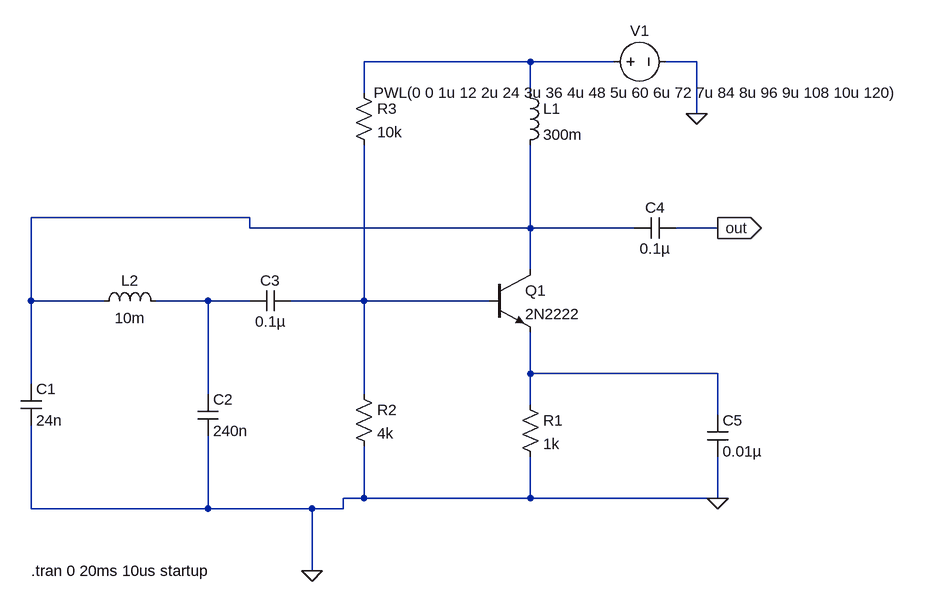
[diagram p0: schematic Colpitt.asc]
Colpitt.asc, the LTspice schematic file:
Version 4
SHEET 1 948 680
WIRE 336 -224 80 -224
WIRE 464 -224 336 -224
WIRE 592 -224 544 -224
WIRE 80 -176 80 -224
WIRE 336 -176 336 -224
WIRE 592 -144 592 -224
WIRE -96 16 -432 16
WIRE -96 32 -96 16
WIRE 336 32 336 -96
WIRE 336 32 -96 32
WIRE 496 32 336 32
WIRE 624 32 560 32
WIRE 336 96 336 32
WIRE -432 144 -432 16
WIRE -320 144 -432 144
WIRE -160 144 -240 144
WIRE -96 144 -160 144
WIRE 80 144 80 -96
WIRE 80 144 -32 144
WIRE 272 144 80 144
WIRE 336 256 336 192
WIRE 624 256 336 256
WIRE -432 272 -432 144
WIRE -160 288 -160 144
WIRE 80 288 80 144
WIRE 336 304 336 256
WIRE 624 320 624 256
WIRE 80 448 80 368
WIRE 80 448 48 448
WIRE 336 448 336 384
WIRE 336 448 80 448
WIRE 624 448 624 384
WIRE 624 448 336 448
WIRE -432 464 -432 336
WIRE -160 464 -160 352
WIRE -160 464 -432 464
WIRE 0 464 -160 464
WIRE 48 464 48 448
WIRE 48 464 0 464
WIRE 0 560 0 464
FLAG 0 560 0
FLAG 592 -144 0
FLAG 624 32 out
IOPIN 624 32 Out
FLAG 624 448 0
SYMBOL npn 272 96 R0
SYMATTR InstName Q1
SYMATTR Value 2N2222
SYMBOL res 320 288 R0
SYMATTR InstName R1
SYMATTR Value 1k
SYMBOL res 64 272 R0
SYMATTR InstName R2
SYMATTR Value 4k
SYMBOL res 64 -192 R0
SYMATTR InstName R3
SYMATTR Value 10k
SYMBOL ind 320 -192 R0
SYMATTR InstName L1
SYMATTR Value 300m
SYMBOL ind -336 160 R270
WINDOW 0 32 56 VTop 2
WINDOW 3 5 56 VBottom 2
SYMATTR InstName L2
SYMATTR Value 10m
SYMBOL cap -448 272 R0
SYMATTR InstName C1
SYMATTR Value 24n
SYMBOL cap -176 288 R0
SYMATTR InstName C2
SYMATTR Value 240n
SYMBOL cap -32 128 R90
WINDOW 0 0 32 VBottom 2
WINDOW 3 32 32 VTop 2
SYMATTR InstName C3
SYMATTR Value 0.1µ
SYMBOL cap 560 16 R90
WINDOW 0 0 32 VBottom 2
WINDOW 3 32 32 VTop 2
SYMATTR InstName C4
SYMATTR Value 0.1µ
SYMBOL cap 608 320 R0
SYMATTR InstName C5
SYMATTR Value 0.01µ
SYMBOL voltage 448 -224 R270
WINDOW 0 32 56 VTop 2
WINDOW 3 -32 56 VBottom 2
WINDOW 123 0 0 Left 0
WINDOW 39 0 0 Left 0
SYMATTR InstName V1
SYMATTR Value PWL(0 0 1u 12 2u 24 3u 36 4u 48 5u 60 6u 72 7u 84 8u 96 9u 108 10u 120)
TEXT -432 560 Left 2 !.tran 0 20ms 10us startup

The netlist it stands for:
* Colpitt.asc
Q1 N002 N004 N005 0 2N2222
R1 N005 0 1k
R2 N004 0 4k
R3 N001 N004 10k
L1 N001 N002 300m
L2 N002 N003 10m
C1 N002 0 24n
C2 N003 0 240n
C3 N004 N003 0.1µ
C4 out N002 0.1µ
C5 N005 0 0.01µ
V1 N001 0 PWL(0 0 1u 12 2u 24 3u 36 4u 48 5u 60 6u 72 7u 84 8u 96 9u 108 10u 120)
.model NPN NPN
.model PNP PNP
.lib standard.bjt
.tran 0 20ms 10us startup
.backanno
.end